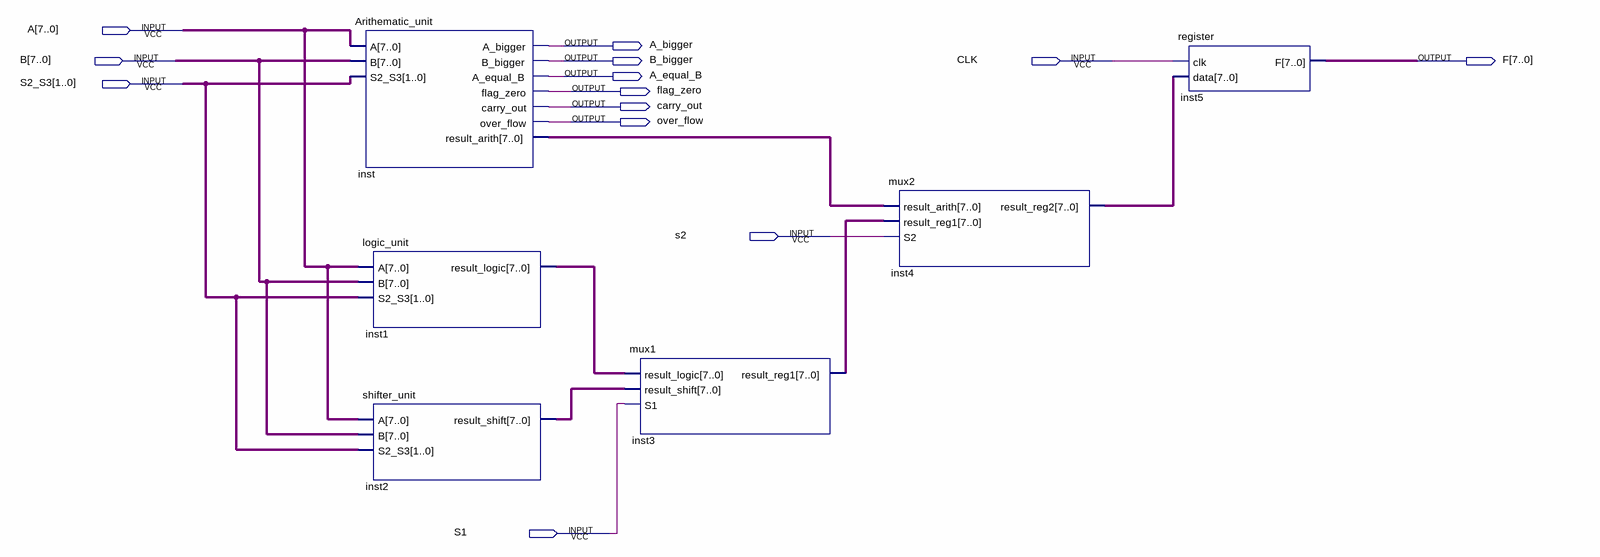
[diagram p0: schematic sheet]
// Quartus schematic ALU.bdf as structural Verilog: 6 symbols, 13 pins
module ALU (
  input  [7:0] A,
  input  [7:0] B,
  input  CLK,
  input  [1:0] S2_S3,
  input  s2,
  input  S1,
  output A_bigger,
  output B_bigger,
  output [7:0] F,
  output A_equal_B,
  output flag_zero,
  output carry_out,
  output over_flow
);

  wire [7:0] inst1_result_logic, inst2_result_shift, inst3_result_reg1, inst4_result_reg2, inst_result_arith;

  Arithematic_unit inst (
    .A(A), .B(B), .S2_S3(S2_S3), .A_bigger(A_bigger), .B_bigger(B_bigger), .A_equal_B(A_equal_B),
    .flag_zero(flag_zero), .carry_out(carry_out), .over_flow(over_flow), .result_arith(inst_result_arith));
  logic_unit inst1 (.A(A), .B(B), .S2_S3(S2_S3), .result_logic(inst1_result_logic));
  shifter_unit inst2 (.A(A), .B(B), .S2_S3(S2_S3), .result_shift(inst2_result_shift));
  mux1 inst3 (
    .result_logic(inst1_result_logic), .result_shift(inst2_result_shift), .S1(S1),
    .result_reg1(inst3_result_reg1));
  mux2 inst4 (
    .result_arith(inst_result_arith), .result_reg1(inst3_result_reg1), .S2(s2),
    .result_reg2(inst4_result_reg2));
  register inst5 (.clk(CLK), .data(inst4_result_reg2), .F(F));
endmodule
